# EAGLE schematic atxpi (EAGLE 6.5.0)
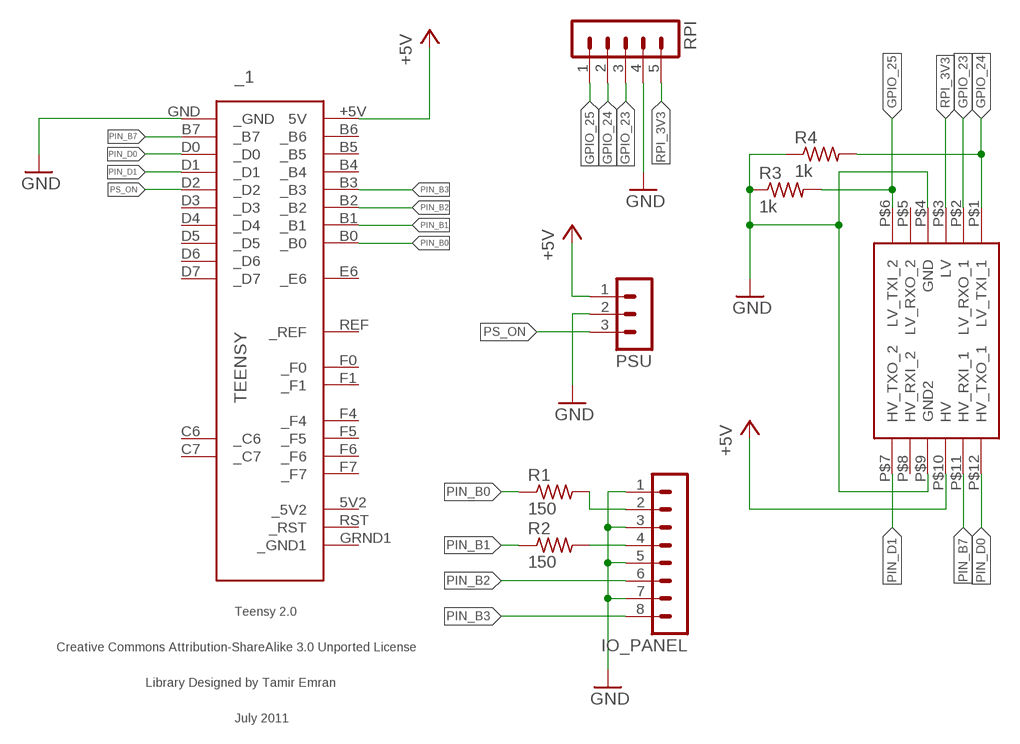
[diagram p0: schematic, sheet 1]

## Parts
_1  TEENSY  [TEENSY]
IO_PANEL  MA08-1  [MA08-1]
PSU  MA03-1  [MA03-1]
R1  150  R-US_0309/12  [0309/12]
R2  150  R-US_0309/12  [0309/12]
R3  1k  R-US_0309/12  [0309/12]
R4  1k  R-US_0309/12  [0309/12]
RPI  MA05-1  [MA05-1]
U$1  LOGIC_LEVEL_CONVERTER  [LOGIC_LEVEL_CONVERTER]

## Nets
+5V: _1.+5V(5V) PSU.1 U$1.P$10(HV)
GND: _1.GND(_GND) IO_PANEL.1 IO_PANEL.3 IO_PANEL.5 IO_PANEL.7 PSU.2 R3.1 R4.1 RPI.4 U$1.P$4(GND) U$1.P$9(GND2)
GPIO_23: RPI.3 U$1.P$2(LV_RXO_1)
GPIO_24: R4.2 RPI.2 U$1.P$1(LV_TXI_1)
GPIO_25: R3.2 RPI.1 U$1.P$6(LV_TXI_2)
HDD_LED: IO_PANEL.4 R2.2
N$1: IO_PANEL.2 R1.2
PIN_B0: _1.B0(_B0) R1.1
PIN_B1: _1.B1(_B1) R2.1
PIN_B2: _1.B2(_B2) IO_PANEL.6
PIN_B3: _1.B3(_B3) IO_PANEL.8
PIN_B7: _1.B7(_B7) U$1.P$11(HV_RXI_1)
PIN_D0: _1.D0(_D0) U$1.P$12(HV_TXO_1)
PIN_D1: _1.D1(_D1) U$1.P$7(HV_TXO_2)
PS_ON: _1.D2(_D2) PSU.3
RPI_3V3: RPI.5 U$1.P$3(LV)
Unconnected: _1.5V2(_5V2) _1.B4(_B4) _1.B5(_B5) _1.B6(_B6) _1.C6(_C6) _1.C7(_C7) _1.D3(_D3) _1.D4(_D4) _1.D5(_D5) _1.D6(_D6) _1.D7(_D7) _1.E6(_E6) _1.F0(_F0) _1.F1(_F1) _1.F4(_F4) _1.F5(_F5) _1.F6(_F6) _1.F7(_F7) _1.GRND1(_GND1) _1.REF(_REF) _1.RST(_RST) U$1.P$5(LV_RXO_2) U$1.P$8(HV_RXI_2)

## Library data of the parts
_1 = teensy:TEENSY: Teensy 2.0 Original Design by Clint Fisher Modified Design by Tamir Emran Licensed Under Creative Commons Attribution-ShareAlike 3.0 Unported (CC BY-SA 3.0)
IO_PANEL = con-lstb:MA08-1: PIN HEADER; OC_FARNELL: unknown; OC_NEWARK: unknown
PSU = con-lstb:MA03-1: PIN HEADER; OC_FARNELL: unknown; OC_NEWARK: unknown
R1 R2 = rcl:R-US_: RESISTOR, American symbol
R3 R4 = resistor:R-US_: RESISTOR, American symbol
RPI = con-lstb:MA05-1: PIN HEADER; OC_FARNELL: unknown; OC_NEWARK: unknown
U$1 = SparkFun-Boards:LOGIC_LEVEL_CONVERTER: Logic Level Converter (3.3v - 5v) https://www.sparkfun.com/products/8745